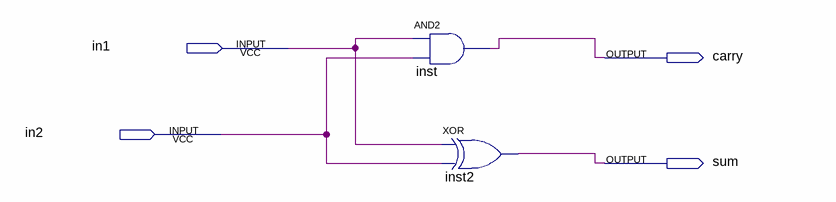
[diagram p0: schematic sheet]
// Quartus schematic halfAdder.bdf as structural Verilog: 2 symbols, 4 pins
module halfAdder (
  input  in1,
  input  in2,
  output carry,
  output sum
);

  and inst (carry, in1, in2);
  xor inst2 (sum, in1, in2);
endmodule
